# EAGLE design clock-test (EAGLE 5.11)
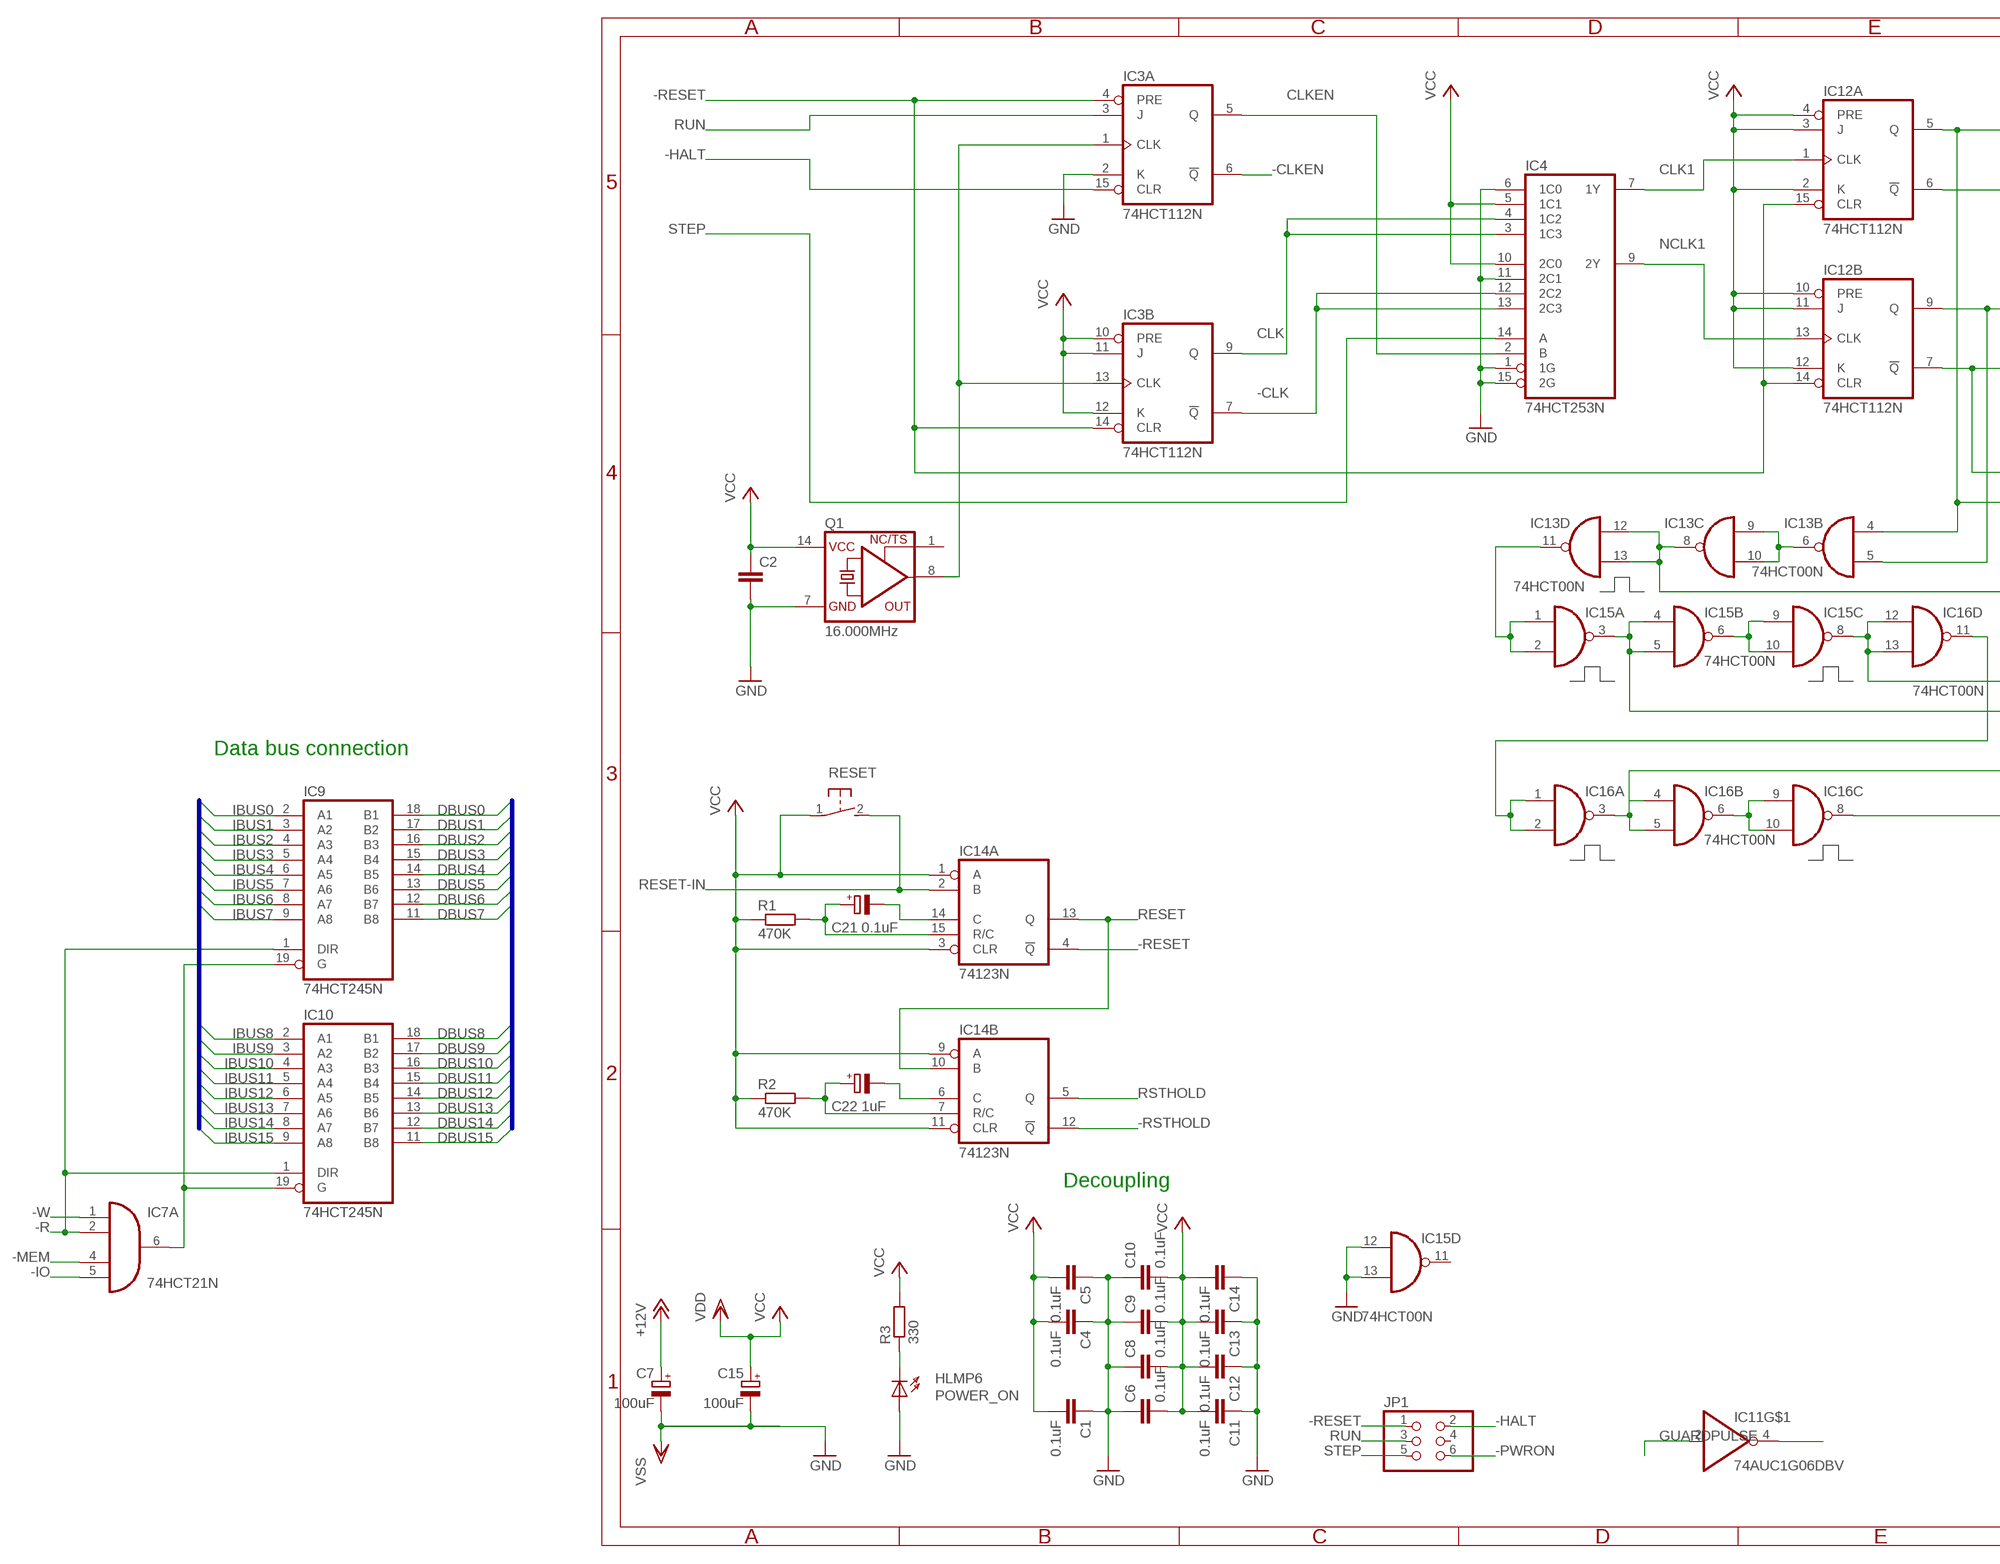
[diagram p0: schematic, sheet 1, part 1 of 2]
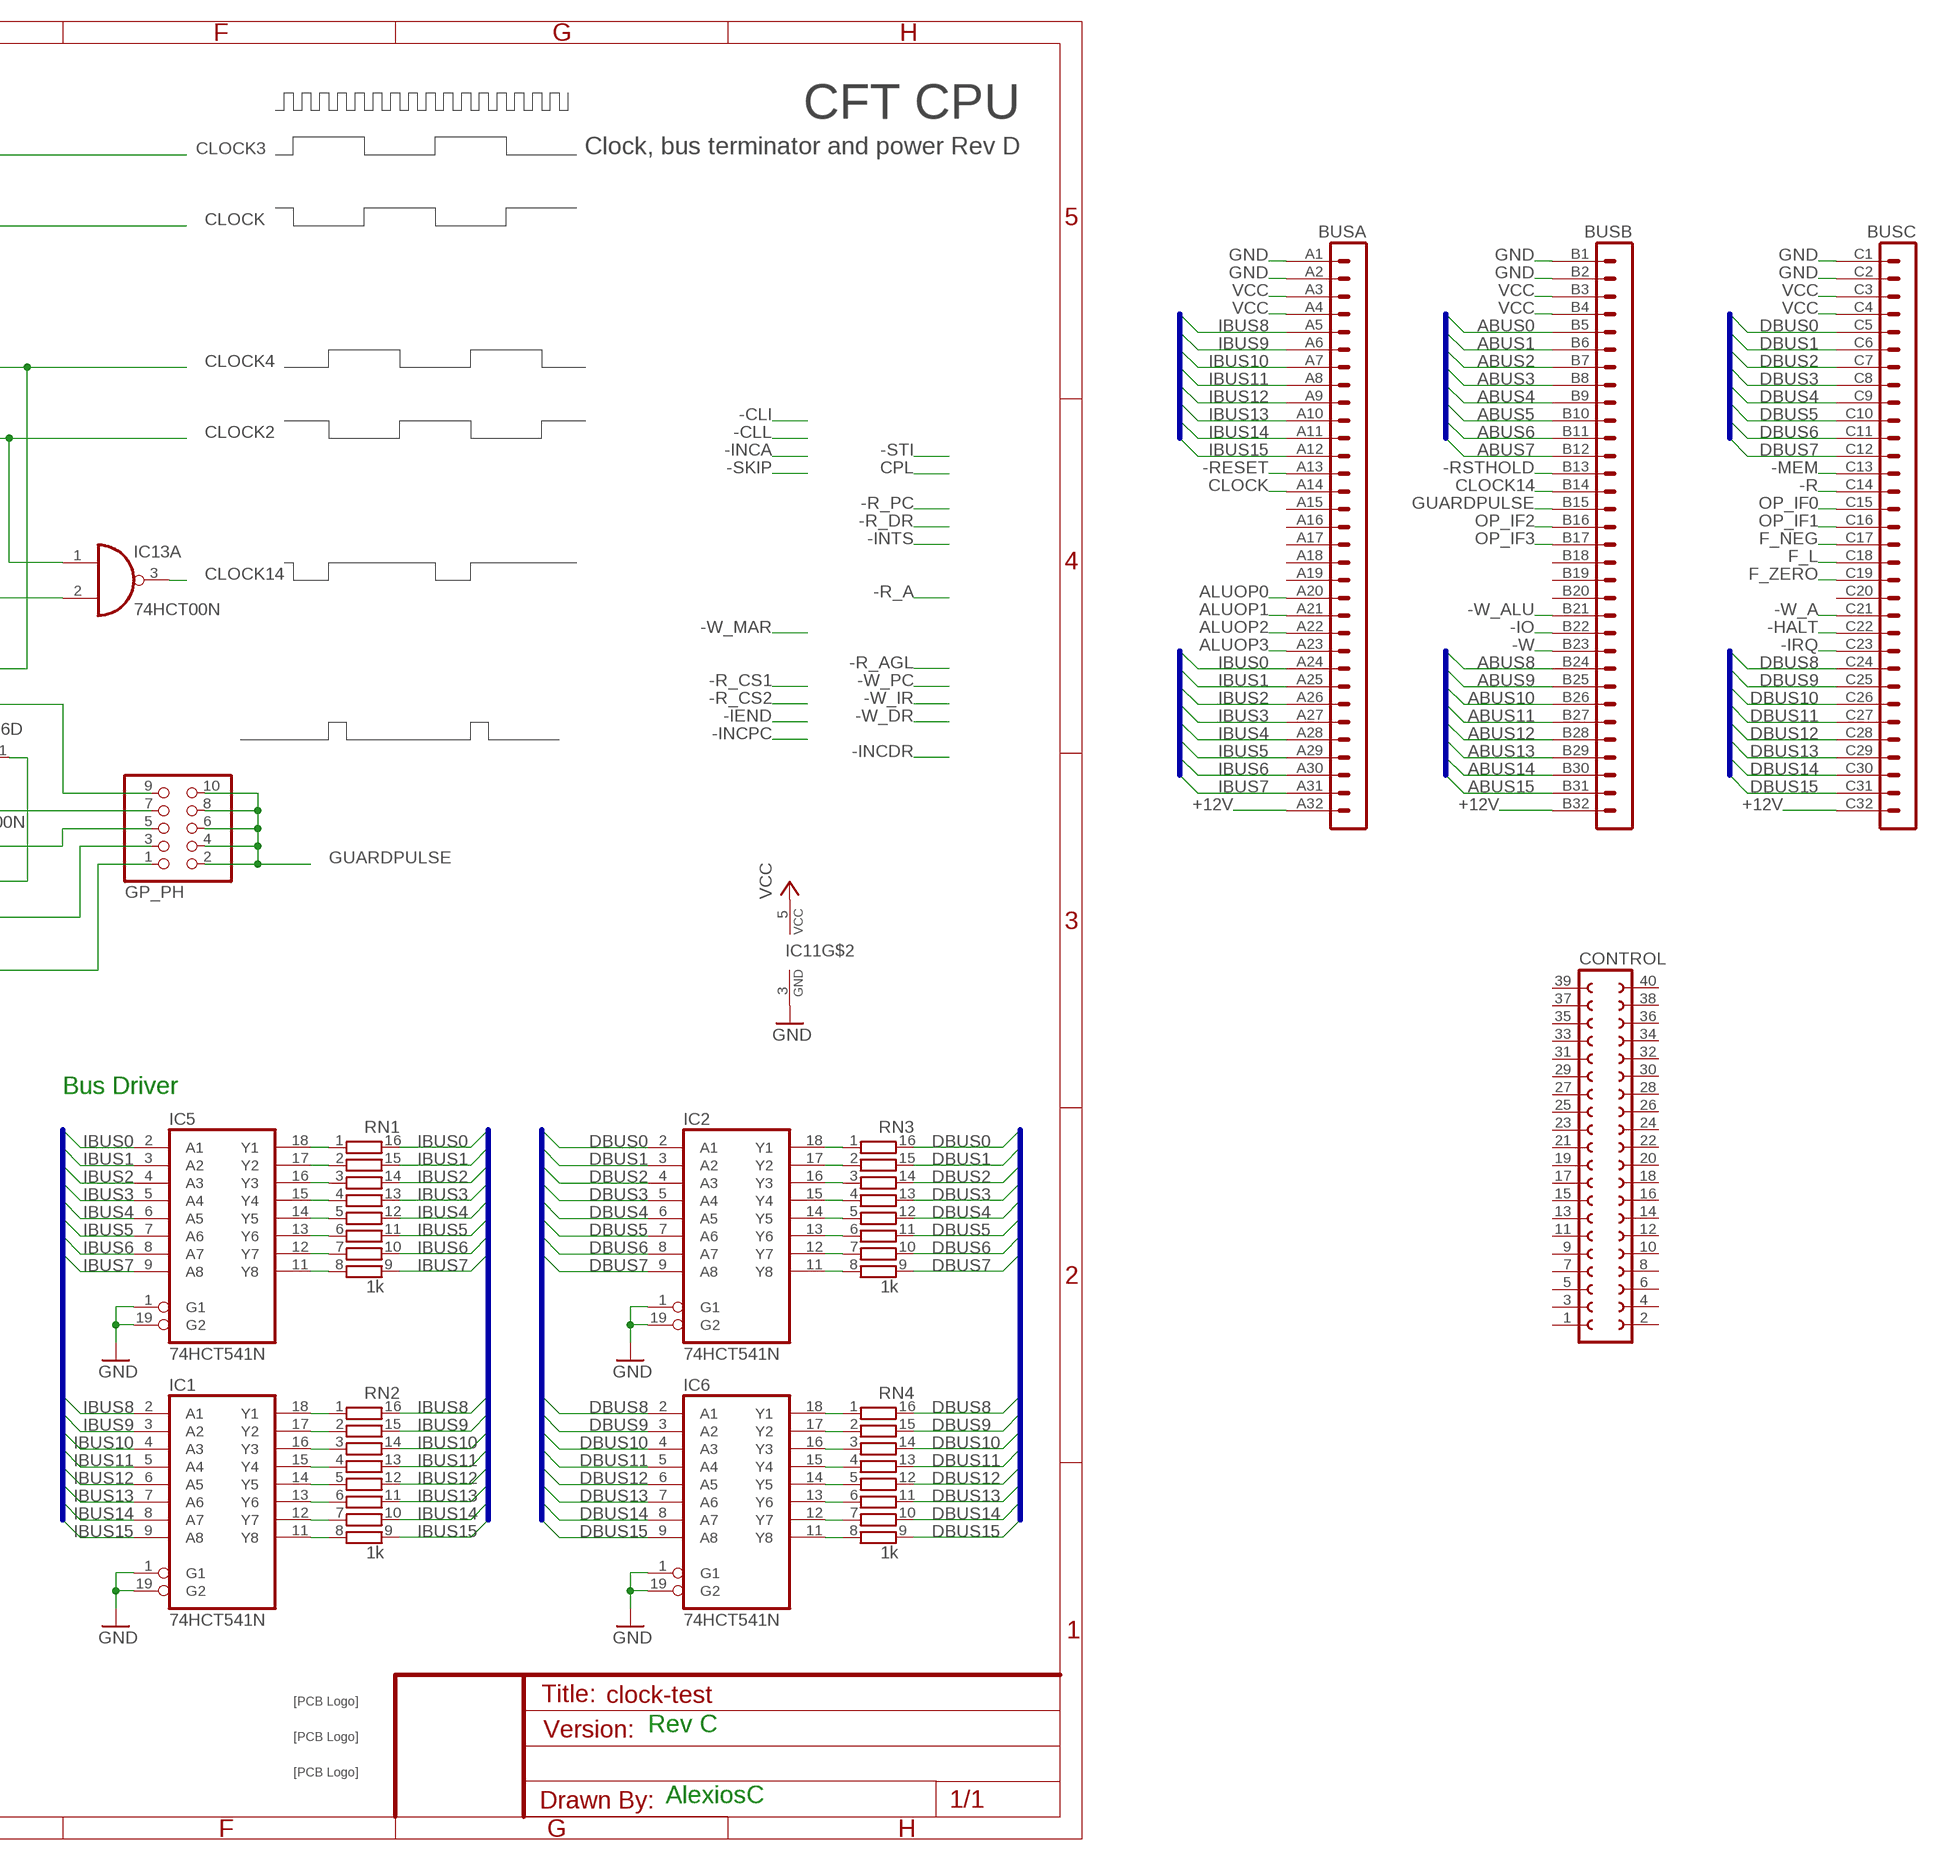
[diagram p1: schematic, sheet 1, part 2 of 2]

## Parts
BUS  VG96-3B  [VG96B]
C1  0.1uF  C-EU025-025X050  [C025-025X050]
C2  C-EU025-025X050  [C025-025X050]
C4  0.1uF  C-EU025-025X050  [C025-025X050]
C5  0.1uF  C-EU025-025X050  [C025-025X050]
C6  0.1uF  C-EU025-025X050  [C025-025X050]
C7  100uF  CPOL-EUE3.5-8  [E3,5-8]
C8  0.1uF  C-EU025-025X050  [C025-025X050]
C9  0.1uF  C-EU025-025X050  [C025-025X050]
C10  0.1uF  C-EU025-025X050  [C025-025X050]
C11  0.1uF  C-EU025-025X050  [C025-025X050]
C12  0.1uF  C-EU025-025X050  [C025-025X050]
C13  0.1uF  C-EU025-025X050  [C025-025X050]
C14  0.1uF  C-EU025-025X050  [C025-025X050]
C15  100uF  CPOL-EUE3.5-8  [E3,5-8]
C21  0.1uF  CPOL-EUE2.5-6  [E2,5-6]
C22  1uF  CPOL-EUE2.5-6  [E2,5-6]
CONTROL  FE20-2  [FE20-2]
GP_PH  PINHD-2X5/90  [2X05/90]
IC1  74HCT541N  [DIL20]
IC2  74HCT541N  [DIL20]
IC3  74HCT112N  [DIL16]
IC4  74HCT253N  [DIL16]
IC5  74HCT541N  [DIL20]
IC6  74HCT541N  [DIL20]
IC7  74HCT21N  [DIL14]
IC9  74HCT245N  [DIL20]
IC10  74HCT245N  [DIL20]
IC11  74AUC1G06DBV  [SOT23-5]
IC12  74HCT112N  [DIL16]
IC13  74HCT00N  [DIL14]
IC14  74123N  [DIL16]
IC15  74HCT00N  [DIL14]
IC16  74HCT00N  [DIL14]
JP1  PINHD-2X3/90  [2X03/90]
POWER_ON  HLMP6  [HLMP6]
Q1  16.000MHz  XO-14  [DIL14S]
R1  470K  R-EU_0204/7  [0204/7]
R2  470K  R-EU_0204/7  [0204/7]
R3  330  R-EU_0204/7  [0204/7]
RESET  31-XX  [B3F-31XX]
RN1  1k  8R-P  [DIL16]
RN2  1k  8R-P  [DIL16]
RN3  1k  8R-P  [DIL16]
RN4  1k  8R-P  [DIL16]
U$1  SIGNATUREPLANE  [SIGNATURE_PLANE]
U$2  SIGNATUREPLANE  [SIGNATURE_PLANE]
U$3  SIGNATURESILK  [SIGNATURE]

## Nets
+12V [12V]: BUS.A32 BUS.B32 BUS.C32 C7.+
-CLK: IC3.7(B:!Q) IC4.12(2C2) IC4.13(2C3)
-CLKEN: IC3.6(A:!Q)
-HALT: BUS.C22 IC3.15(A:CLR) JP1.2
-IO: BUS.B22 IC7.5(A:I3)
-IRQ: BUS.C23
-MEM: BUS.C13 IC7.4(A:I2)
-PWRON: JP1.6
-R: BUS.C14 IC7.2(A:I1) IC9.1(DIR) IC10.1(DIR)
-RESET: BUS.A13 IC3.4(A:PRE) IC3.14(B:CLR) IC12.14(B:CLR) IC12.15(A:CLR) IC14.4(A:!Q) JP1.1
-RSTHOLD: BUS.B13 IC14.12(B:!Q)
-W: BUS.B23 IC7.1(A:I0)
-W_A: BUS.C21
-W_ALU: BUS.B21
ABUS0: BUS.B5
ABUS1: BUS.B6
ABUS2: BUS.B7
ABUS3: BUS.B8
ABUS4: BUS.B9
ABUS5: BUS.B10
ABUS6: BUS.B11
ABUS7: BUS.B12
ABUS8: BUS.B24
ABUS9: BUS.B25
ABUS10: BUS.B26
ABUS11: BUS.B27
ABUS12: BUS.B28
ABUS13: BUS.B29
ABUS14: BUS.B30
ABUS15: BUS.B31
ALUOP0: BUS.A20 IC11.4(O)
ALUOP1: BUS.A21
ALUOP2: BUS.A22
ALUOP3: BUS.A23
CLK: IC3.9(B:Q) IC4.3(1C3) IC4.4(1C2)
CLK1: IC4.7(1Y) IC12.1(A:CLK)
CLKEN: IC3.5(A:Q) IC4.2(B)
CLOCK: BUS.A14 IC12.6(A:!Q)
CLOCK2: IC12.7(B:!Q) IC13.1(A:I0)
CLOCK3: IC12.5(A:Q) IC13.2(A:I1) IC13.4(B:I0)
CLOCK4: IC12.9(B:Q) IC13.5(B:I1)
CLOCK14: BUS.B14 IC13.3(A:O)
DBUS0: BUS.C5 IC2.2(A1) IC9.18(B1) RN3.16
DBUS1: BUS.C6 IC2.3(A2) IC9.17(B2) RN3.15
DBUS2: BUS.C7 IC2.4(A3) IC9.16(B3) RN3.14
DBUS3: BUS.C8 IC2.5(A4) IC9.15(B4) RN3.13
DBUS4: BUS.C9 IC2.6(A5) IC9.14(B5) RN3.12
DBUS5: BUS.C10 IC2.7(A6) IC9.13(B6) RN3.11
DBUS6: BUS.C11 IC2.8(A7) IC9.12(B7) RN3.10
DBUS7: BUS.C12 IC2.9(A8) IC9.11(B8) RN3.9
DBUS8: BUS.C24 IC6.2(A1) IC10.18(B1) RN4.16
DBUS9: BUS.C25 IC6.3(A2) IC10.17(B2) RN4.15
DBUS10: BUS.C26 IC6.4(A3) IC10.16(B3) RN4.14
DBUS11: BUS.C27 IC6.5(A4) IC10.15(B4) RN4.13
DBUS12: BUS.C28 IC6.6(A5) IC10.14(B5) RN4.12
DBUS13: BUS.C29 IC6.7(A6) IC10.13(B6) RN4.11
DBUS14: BUS.C30 IC6.8(A7) IC10.12(B7) RN4.10
DBUS15: BUS.C31 IC6.9(A8) IC10.11(B8) RN4.9
F_L: BUS.C18
F_NEG: BUS.C17
F_ZERO: BUS.C19
GND: BUS.A1 BUS.A2 BUS.B1 BUS.B2 BUS.C1 BUS.C2 C1.1 C2.2 C4.1 C5.1 C6.1 C7.- C8.1 C9.1 C10.1 C11.1 C12.1 C13.1 C14.1 IC1.1(G1) IC1.19(G2) IC2.1(G1) IC2.19(G2) IC3.2(A:K) IC4.1(1G) IC4.6(1C0) IC4.11(2C1) IC4.15(2G) IC5.1(G1) IC5.19(G2) IC6.1(G1) IC6.19(G2) IC11.3(GND) IC15.12(D:I0) IC15.13(D:I1) POWER_ON.A Q1.7(GND) ; supply symbol labelled VSS
GUARDPULSE: BUS.B15 GP_PH.2 GP_PH.4 GP_PH.6 GP_PH.8 GP_PH.10 IC11.2(I)
IBUS0: BUS.A24 IC5.2(A1) IC9.2(A1) RN1.16
IBUS1: BUS.A25 IC5.3(A2) IC9.3(A2) RN1.15
IBUS2: BUS.A26 IC5.4(A3) IC9.4(A3) RN1.14
IBUS3: BUS.A27 IC5.5(A4) IC9.5(A4) RN1.13
IBUS4: BUS.A28 IC5.6(A5) IC9.6(A5) RN1.12
IBUS5: BUS.A29 IC5.7(A6) IC9.7(A6) RN1.11
IBUS6: BUS.A30 IC5.8(A7) IC9.8(A7) RN1.10
IBUS7: BUS.A31 IC5.9(A8) IC9.9(A8) RN1.9
IBUS8: BUS.A5 IC1.2(A1) IC10.2(A1) RN2.16
IBUS9: BUS.A6 IC1.3(A2) IC10.3(A2) RN2.15
IBUS10: BUS.A7 IC1.4(A3) IC10.4(A3) RN2.14
IBUS11: BUS.A8 IC1.5(A4) IC10.5(A4) RN2.13
IBUS12: BUS.A9 IC1.6(A5) IC10.6(A5) RN2.12
IBUS13: BUS.A10 IC1.7(A6) IC10.7(A6) RN2.11
IBUS14: BUS.A11 IC1.8(A7) IC10.8(A7) RN2.10
IBUS15: BUS.A12 IC1.9(A8) IC10.9(A8) RN2.9
N$1: IC5.18(Y1) RN1.1
N$2: GP_PH.1 IC16.8(C:O)
N$3: C15.-
N$4: IC5.17(Y2) RN1.2
N$5: IC3.1(A:CLK) IC3.13(B:CLK) Q1.8(OUT)
N$6: C21.+ IC14.15(A:R/C) R1.2
N$7: IC5.16(Y3) RN1.3
N$8: C21.- IC14.14(A:C)
N$9: C22.+ IC14.7(B:R/C) R2.2
N$10: C22.- IC14.6(B:C)
N$11: GP_PH.5 IC15.3(A:O) IC15.4(B:I0) IC15.5(B:I1)
N$12: IC15.6(B:O) IC15.9(C:I0) IC15.10(C:I1)
N$13: GP_PH.7 IC15.8(C:O) IC16.12(D:I0) IC16.13(D:I1)
N$14: IC16.1(A:I0) IC16.2(A:I1) IC16.11(D:O)
N$15: GP_PH.3 IC16.3(A:O) IC16.4(B:I0) IC16.5(B:I1)
N$16: IC16.6(B:O) IC16.9(C:I0) IC16.10(C:I1)
N$17: IC5.15(Y4) RN1.4
N$18: IC13.6(B:O) IC13.9(C:I0) IC13.10(C:I1)
N$19: GP_PH.9 IC13.8(C:O) IC13.12(D:I0) IC13.13(D:I1)
N$20: IC13.11(D:O) IC15.1(A:I0) IC15.2(A:I1)
N$21: IC5.14(Y5) RN1.5
N$22: IC5.13(Y6) RN1.6
N$23: IC5.12(Y7) RN1.7
N$24: IC5.11(Y8) RN1.8
N$25: IC1.18(Y1) RN2.1
N$26: IC1.17(Y2) RN2.2
N$27: IC1.16(Y3) RN2.3
N$28: IC1.15(Y4) RN2.4
N$29: IC1.14(Y5) RN2.5
N$30: IC1.13(Y6) RN2.6
N$31: IC1.12(Y7) RN2.7
N$32: IC1.11(Y8) RN2.8
N$33: IC2.18(Y1) RN3.1
N$34: IC2.17(Y2) RN3.2
N$35: IC2.16(Y3) RN3.3
N$36: IC2.15(Y4) RN3.4
N$37: IC2.14(Y5) RN3.5
N$38: IC2.13(Y6) RN3.6
N$39: IC2.12(Y7) RN3.7
N$40: IC2.11(Y8) RN3.8
N$41: IC6.18(Y1) RN4.1
N$42: IC6.17(Y2) RN4.2
N$43: IC6.16(Y3) RN4.3
N$44: IC6.15(Y4) RN4.4
N$45: IC6.14(Y5) RN4.5
N$46: IC6.13(Y6) RN4.6
N$47: IC6.12(Y7) RN4.7
N$48: IC6.11(Y8) RN4.8
N$49: IC7.6(A:O) IC9.19(G) IC10.19(G)
NCLK1: IC4.9(2Y) IC12.13(B:CLK)
OP_IF0: BUS.C15
OP_IF1: BUS.C16
OP_IF2: BUS.B16
OP_IF3: BUS.B17
POWERLED: POWER_ON.K R3.1
RESET: IC14.10(B:B) IC14.13(A:Q)
RESET-IN: IC14.2(A:B) RESET.2(S)
RSTHOLD: IC14.5(B:Q)
RUN: IC3.3(A:J) JP1.3
STEP: IC4.14(A) JP1.5
VCC: BUS.A3 BUS.A4 BUS.B3 BUS.B4 BUS.C3 BUS.C4 C1.2 C2.1 C4.2 C5.2 C6.2 C8.2 C9.2 C10.2 C11.2 C12.2 C13.2 C14.2 C15.+ IC3.10(B:PRE) IC3.11(B:J) IC3.12(B:K) IC4.5(1C1) IC4.10(2C0) IC11.5(VCC) IC12.2(A:K) IC12.3(A:J) IC12.4(A:PRE) IC12.10(B:PRE) IC12.11(B:J) IC12.12(B:K) IC14.1(A:A) IC14.3(A:CLR) IC14.9(B:A) IC14.11(B:CLR) Q1.14(VCC) R1.1 R2.1 R3.2 RESET.1(P) ; supply symbol labelled VDD
Unconnected: BUS.A15 BUS.A16 BUS.A17 BUS.A18 BUS.A19 BUS.B18 BUS.B19 BUS.B20 BUS.C20 CONTROL.1 CONTROL.2 CONTROL.3 CONTROL.4 CONTROL.5 CONTROL.6 CONTROL.7 CONTROL.8 CONTROL.9 CONTROL.10 CONTROL.11 CONTROL.12 CONTROL.13 CONTROL.14 CONTROL.15 CONTROL.16 CONTROL.17 CONTROL.18 CONTROL.19 CONTROL.20 CONTROL.21 CONTROL.22 CONTROL.23 CONTROL.24 CONTROL.25 CONTROL.26 CONTROL.27 CONTROL.28 CONTROL.29 CONTROL.30 CONTROL.31 CONTROL.32 CONTROL.33 CONTROL.34 CONTROL.35 CONTROL.36 CONTROL.37 CONTROL.38 CONTROL.39 CONTROL.40 IC7.8(B:O) IC7.9(B:I0) IC7.10(B:I1) IC7.12(B:I2) IC7.13(B:I3) IC15.11(D:O) JP1.4 Q1.1(TS)

## Buses
ABUS[0..15]
DBUS[0..15]
IBUS[0..15]

## Notes on the sheet
- CFT CPU
- Clock, bus terminator and power Rev D
- Data bus connection
- Bus Driver
- Decoupling
- Rev C
- AlexiosC

## Power pins joined to a net without a drawn wire
GND: IC1.10(GND) IC2.10(GND) IC3.8(P:GND) IC4.8(GND) IC5.10(GND) IC6.10(GND) IC7.7(P:GND) IC9.10(GND) IC10.10(GND) IC12.8(P:GND) IC13.7(P:GND) IC14.8(P:GND) IC15.7(P:GND) IC16.7(P:GND)
VCC: IC1.20(VCC) IC2.20(VCC) IC3.16(P:VCC) IC4.16(VCC) IC5.20(VCC) IC6.20(VCC) IC7.14(P:VCC) IC9.20(VCC) IC10.20(VCC) IC12.16(P:VCC) IC13.14(P:VCC) IC14.16(P:VCC) IC15.14(P:VCC) IC16.14(P:VCC)

## Library data of the parts
BUS = 19inch:VG96-3: PCB EUROCARD, 96-pin type C/ABC, 2.54 mm
C1 C2 C4-C6 C8-C14 = rcl:C-EU: CAPACITOR, European symbol
C7 C15 C21 C22 = rcl:CPOL-EU: POLARIZED CAPACITOR, European symbol
CONTROL = con-lsta:FE20-2: FEMALE HEADER; OC_FARNELL: unknown; OC_NEWARK: unknown
GP_PH = pinhead:PINHD-2X5: PIN HEADER
IC1 IC2 IC5 IC6 = 74xx-eu:74*541: Octal BUFFER and LINE DRIVER, 3-state
IC3 IC12 = 74xx-eu:74*112: Dual J-K negative edge triggered FLIP FLOP, preset and clear
IC4 = 74xx-eu:74*253: Dual 4-to 1 line data SELECTOR/MULTIPLEXER, 3-state
IC7 = 74xx-eu:74*21: Dual 4-input AND gate
IC9 IC10 = 74xx-eu:74*245: Octal BUS TRANSCEIVER, 3-state
IC11 = 74xx-little-de:74*1G06: Single Inverter Buffer/Driver With Open-Drain Output
IC13 IC15 IC16 = 74xx-eu:74*00: Quad 2-input NAND gate
IC14 = 74xx-eu:74*123: Retriggerable monostable MULTIVIBRATOR
JP1 = pinhead:PINHD-2X3: PIN HEADER
POWER_ON = display-hp:HLMP6: LED 2mm horizontal; MF: AGILENT TECHNOLOGIES; MPN: HLMP-6500; OC_FARNELL: 1652490; OC_NEWARK: 40K0088
Q1 = crystal:XO-14: CRYSTAL RESONATOR
R1-R3 = resistor:R-EU_: RESISTOR, European symbol
RESET = switch-omron:31-XX: OMRON SWITCH
RN1-RN4 = resistor-dil:8R-P: DIL RESISTOR; OC_FARNELL: unknown; OC_NEWARK: unknown
U$1-U$3 = alexios:SIGNATURE: Soup signature

## Net classes
0 default: width 0.406 mm, clearance 0.305 mm
1 Decoupling: width 1.27 mm
2 12V: width 1.016 mm, clearance 1.016 mm

## Board
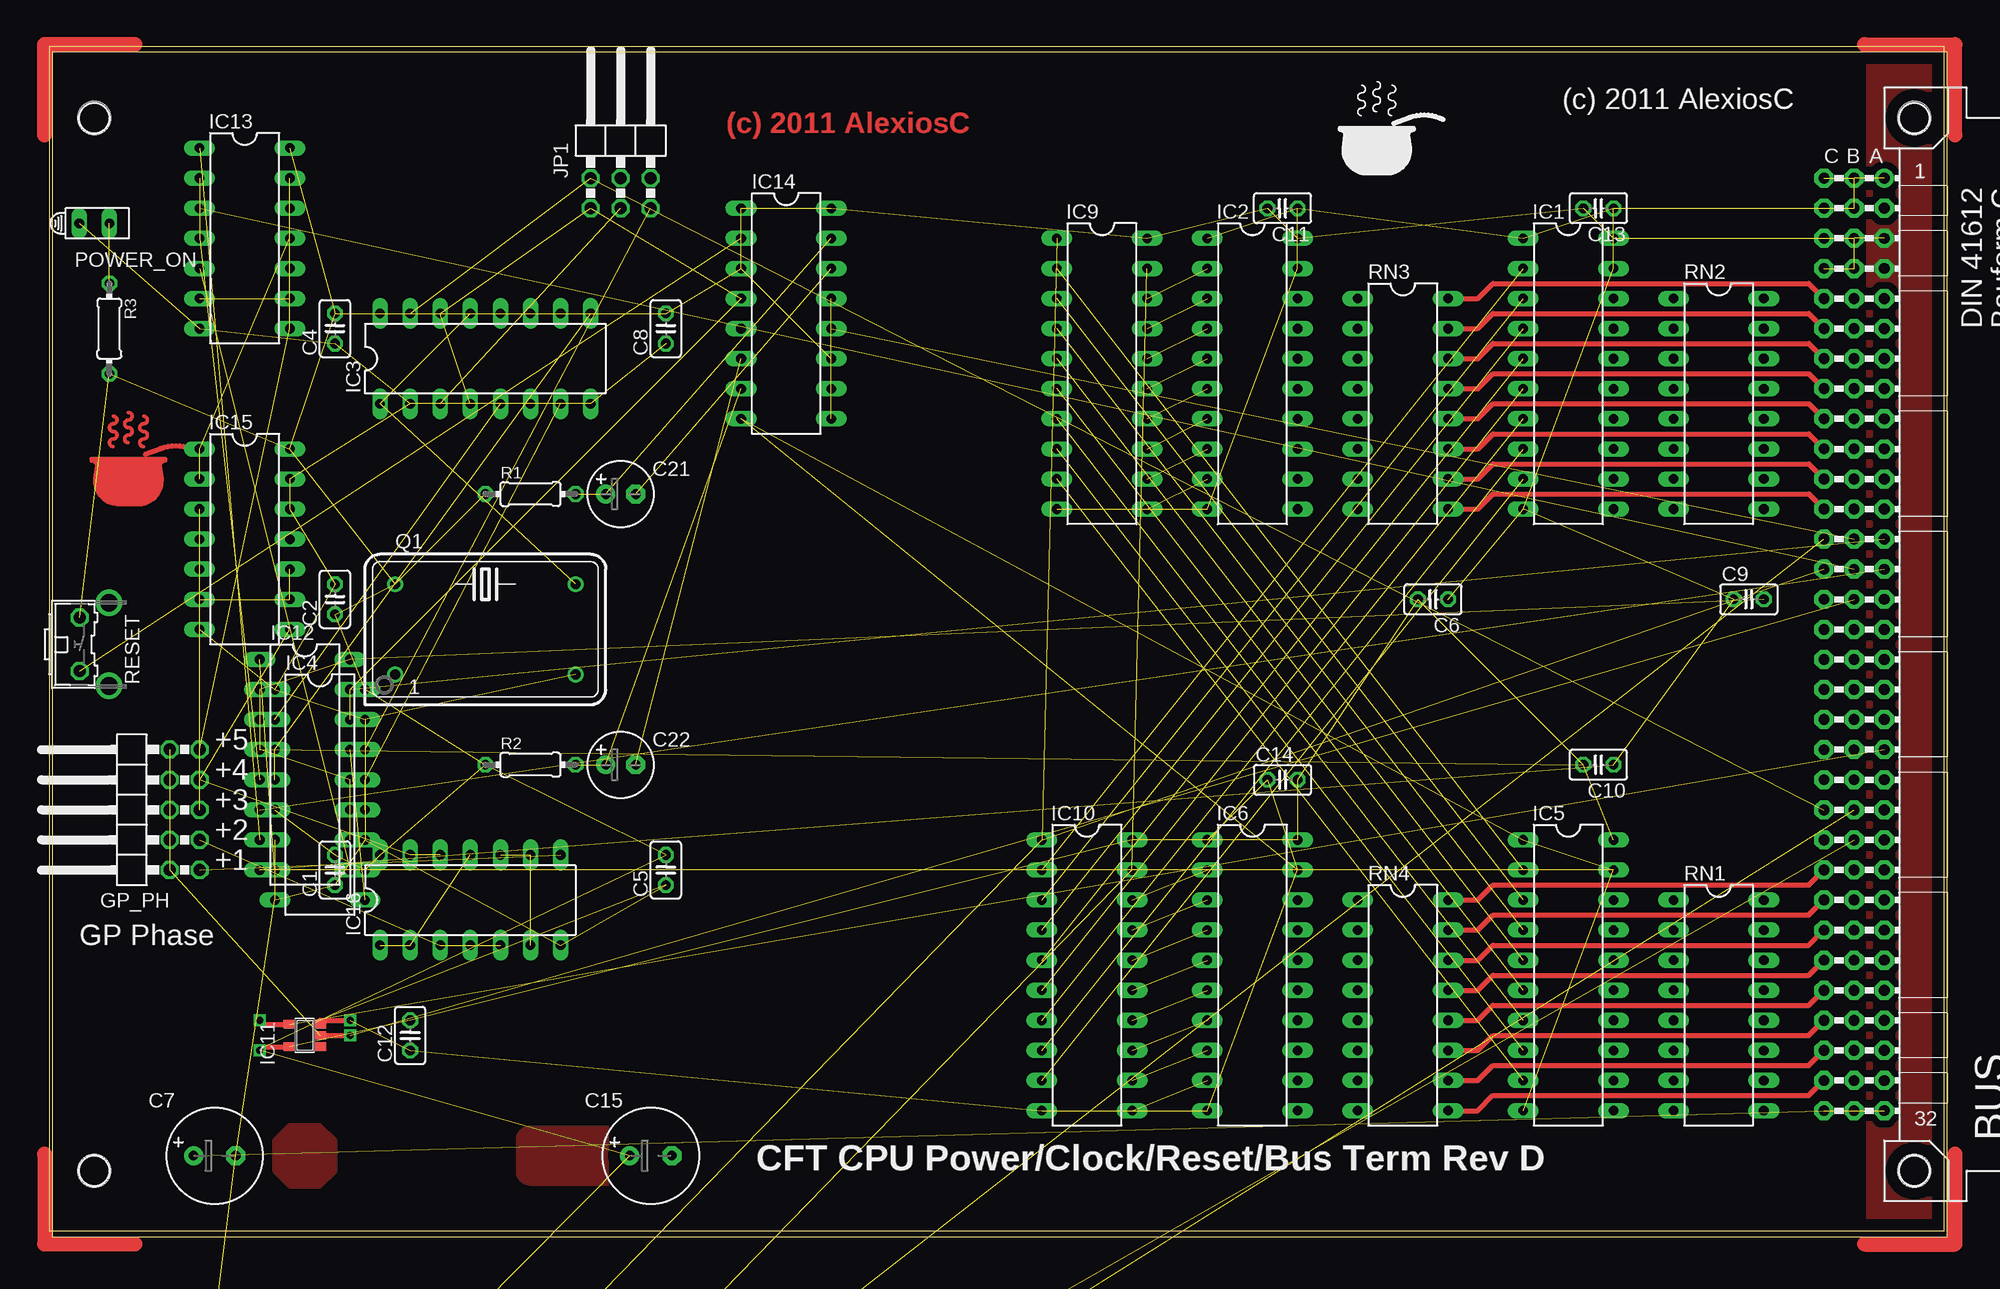
[diagram p2: board, top side]
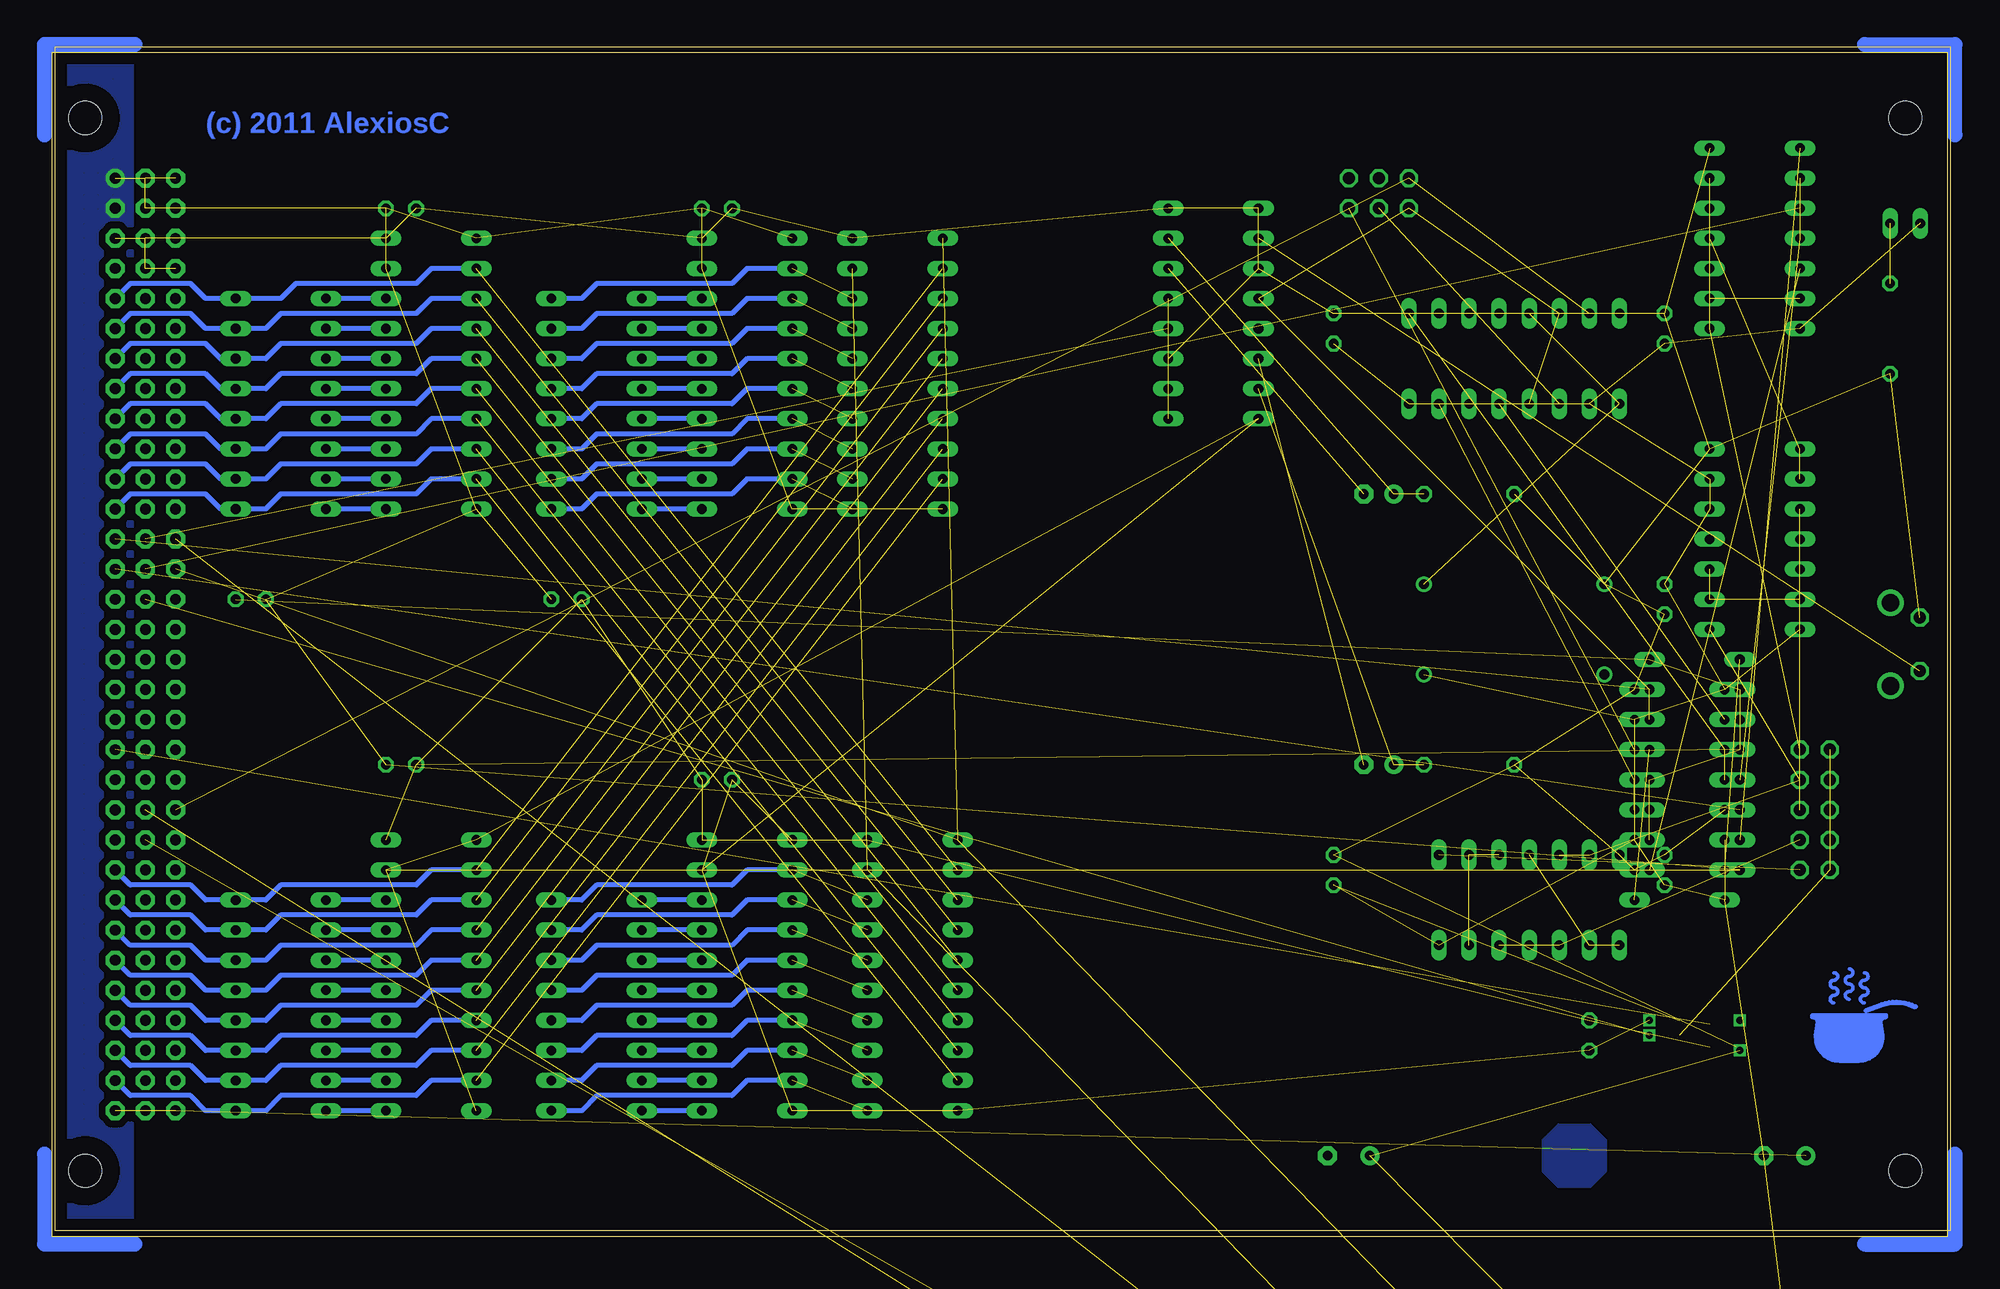
[diagram p3: board, bottom side, seen from below]

Size 160 x 100 mm. Coordinates in mm from the lower left corner, seen from the top.
Outline: 0,0 160,0 160,100 0,100 0,0
Copper layers (1*16): Top 0.035mm / dielectric 1.5mm / Bottom 0.035mm
Design rules "olimex-10mil": minimum track width 10mil, minimum drill 24mil, track to track 10mil, track to pad 10mil, pad to pad 10mil, via to via 10mil, smd to smd 10mil, copper to edge 40mil, drill to drill 10mil, minimum pad ring 10mil, minimum via ring 8mil, stop-mask expansion 0mil, vias tented up to drill 0mil, thermal gap 10mil

### Footprints (pad centres in the part's own frame; a part is rotated, then mirrored left to right if it is on the bottom)
VG96B = drill 0.914 pad 1.6 round: A1 154.94,39.37 | drill 0.914 pad 1.6 octagon: A2 154.94,36.83; A3 154.94,34.29; A4 154.94,31.75; A5 154.94,29.21; A6 154.94,26.67; A7 154.94,24.13; A8 154.94,21.59; A9 154.94,19.05; A10 154.94,16.51; A11 154.94,13.97; A12 154.94,11.43; A13 154.94,8.89; A14 154.94,6.35; A15 154.94,3.81; A16 154.94,1.27; A17 154.94,-1.27; A18 154.94,-3.81; A19 154.94,-6.35; A20 154.94,-8.89; A21 154.94,-11.43; A22 154.94,-13.97; A23 154.94,-16.51; A24 154.94,-19.05; A25 154.94,-21.59; A26 154.94,-24.13; A27 154.94,-26.67; A28 154.94,-29.21; A29 154.94,-31.75; A30 154.94,-34.29; A31 154.94,-36.83; A32 154.94,-39.37; B1 152.4,39.37; B2 152.4,36.83; B3 152.4,34.29; B4 152.4,31.75; B5 152.4,29.21; B6 152.4,26.67; B7 152.4,24.13; B8 152.4,21.59; B9 152.4,19.05; B10 152.4,16.51; B11 152.4,13.97; B12 152.4,11.43; B13 152.4,8.89; B14 152.4,6.35; B15 152.4,3.81; B16 152.4,1.27; B17 152.4,-1.27; B18 152.4,-3.81; B19 152.4,-6.35; B20 152.4,-8.89; B21 152.4,-11.43; B22 152.4,-13.97; B23 152.4,-16.51; B24 152.4,-19.05; B25 152.4,-21.59; B26 152.4,-24.13; B27 152.4,-26.67; B28 152.4,-29.21; B29 152.4,-31.75; B30 152.4,-34.29; B31 152.4,-36.83; B32 152.4,-39.37; C1 149.86,39.37; C2 149.86,36.83; C3 149.86,34.29; C4 149.86,31.75; C5 149.86,29.21; C6 149.86,26.67; C7 149.86,24.13; C8 149.86,21.59; C9 149.86,19.05; C10 149.86,16.51; C11 149.86,13.97; C12 149.86,11.43; C13 149.86,8.89; C14 149.86,6.35; C15 149.86,3.81; C16 149.86,1.27; C17 149.86,-1.27; C18 149.86,-3.81; C19 149.86,-6.35; C20 149.86,-8.89; C21 149.86,-11.43; C22 149.86,-13.97; C23 149.86,-16.51; C24 149.86,-19.05; C25 149.86,-21.59; C26 149.86,-24.13; C27 149.86,-26.67; C28 149.86,-29.21; C29 149.86,-31.75; C30 149.86,-34.29; C31 149.86,-36.83; C32 149.86,-39.37 | hole 2.794: 157.48,44.45; 157.48,-44.45; 3.81,44.45; 3.81,-44.45
C025-025X050 = drill 0.813 octagon: 1 -1.27,0; 2 1.27,0
E3,5-8 = drill 0.813 pad 1.6 round: + -1.778,0 | drill 0.813 pad 1.6 octagon: - 1.778,0
E2,5-6 = drill 0.813 pad 1.6 round: + -1.27,0 | drill 0.813 pad 1.6 octagon: - 1.27,0
FE20-2 = drill 0.914 round: 1 -24.13,1.27 | drill 0.914 octagon: 2 -24.13,-1.27; 3 -21.59,1.27; 4 -21.59,-1.27; 5 -19.05,1.27; 6 -19.05,-1.27; 7 -16.51,1.27; 8 -16.51,-1.27; 9 -13.97,1.27; 10 -13.97,-1.27; 11 -11.43,1.27; 12 -11.43,-1.27; 13 -8.89,1.27; 14 -8.89,-1.27; 15 -6.35,1.27; 16 -6.35,-1.27; 17 -3.81,1.27; 18 -3.81,-1.27; 19 -1.27,1.27; 20 -1.27,-1.27; 21 1.27,1.27; 22 1.27,-1.27; 23 3.81,1.27; 24 3.81,-1.27; 25 6.35,1.27; 26 6.35,-1.27; 27 8.89,1.27; 28 8.89,-1.27; 29 11.43,1.27; 30 11.43,-1.27; 31 13.97,1.27; 32 13.97,-1.27; 33 16.51,1.27; 34 16.51,-1.27; 35 19.05,1.27; 36 19.05,-1.27; 37 21.59,1.27; 38 21.59,-1.27; 39 24.13,1.27; 40 24.13,-1.27
2X05/90 = drill 1.016 octagon: 1 -5.08,-6.35; 2 -5.08,-3.81; 3 -2.54,-6.35; 4 -2.54,-3.81; 5 0,-6.35; 6 0,-3.81; 7 2.54,-6.35; 8 2.54,-3.81; 9 5.08,-6.35; 10 5.08,-3.81
DIL20 = drill 0.813 long: 1 -11.43,-3.81; 2 -8.89,-3.81; 3 -6.35,-3.81; 4 -3.81,-3.81; 5 -1.27,-3.81; 6 1.27,-3.81; 7 3.81,-3.81; 8 6.35,-3.81; 9 8.89,-3.81; 10 11.43,-3.81; 11 11.43,3.81; 12 8.89,3.81; 13 6.35,3.81; 14 3.81,3.81; 15 1.27,3.81; 16 -1.27,3.81; 17 -3.81,3.81; 18 -6.35,3.81; 19 -8.89,3.81; 20 -11.43,3.81
DIL16 = drill 0.813 long: 1 -8.89,-3.81; 2 -6.35,-3.81; 3 -3.81,-3.81; 4 -1.27,-3.81; 5 1.27,-3.81; 6 3.81,-3.81; 7 6.35,-3.81; 8 8.89,-3.81; 9 8.89,3.81; 10 6.35,3.81; 11 3.81,3.81; 12 1.27,3.81; 13 -1.27,3.81; 14 -3.81,3.81; 15 -6.35,3.81; 16 -8.89,3.81
DIL14 = drill 0.813 long: 1 -7.62,-3.81; 2 -5.08,-3.81; 3 -2.54,-3.81; 4 0,-3.81; 5 2.54,-3.81; 6 5.08,-3.81; 7 7.62,-3.81; 8 7.62,3.81; 9 5.08,3.81; 10 2.54,3.81; 11 0,3.81; 12 -2.54,3.81; 13 -5.08,3.81; 14 -7.62,3.81
SOT23-5 = smd 0.69 x 0.99: 1 -0.95,-1.29; 2 0,-1.29; 3 0.95,-1.29; 4 0.95,1.3; 5 -0.95,1.3
2X03/90 = drill 1.016 octagon: 1 -2.54,-6.35; 2 -2.54,-3.81; 3 0,-6.35; 4 0,-3.81; 5 2.54,-6.35; 6 2.54,-3.81
HLMP6 = drill 0.813 long: A -1.27,0; K 1.27,0
DIL14S = drill 0.813 round: 1 -7.62,-3.81; 7 7.62,-3.81; 8 7.62,3.81; 14 -7.62,3.81
0204/7 = drill 0.813 octagon: 1 -3.81,0; 2 3.81,0
B3F-31XX = drill 1.016 octagon: 1 -2.261,-1.245; 2 2.261,-1.245 | drill 1.499 pad 2.159 round: 3 -3.505,1.245; 4 3.505,1.245

### Placement (x,y rotation side)
BUS  0,49.53 0 top
C1  24.13,30.48 90 top
C2  24.13,53.34 90 top
C4  24.13,76.2 90 top
C5  52.07,30.48 90 top
C6  116.84,53.34 180 top
C7  13.97,6.35 0 top
C8  52.07,76.2 90 top
C9  143.51,53.34 0 top
C10  130.81,39.37 180 top
C11  104.14,86.36 180 top
C12  30.48,16.51 90 top
C13  130.81,86.36 180 top
C14  104.14,38.1 0 top
C15  50.8,6.35 0 top
C21  48.26,62.23 0 top
C22  48.26,39.37 0 top
CONTROL  13.97,-67.31 0 top  (outside the outline)
GP_PH  6.35,35.56 90 top
IC1  128.27,72.39 270 top
IC2  101.6,72.39 270 top
IC3  36.83,73.66 0 top
IC4  22.86,36.83 270 top
IC5  128.27,21.59 270 top
IC6  101.6,21.59 270 top
IC7  0,-54.61 0 top  (outside the outline)
IC9  88.9,72.39 270 top
IC10  87.63,21.59 270 top
IC11  21.59,16.51 90 top
IC12  21.59,39.37 270 top
IC13  16.51,83.82 270 top
IC14  62.23,77.47 270 top
IC15  16.51,58.42 270 top
IC16  35.56,27.94 0 top
JP1  48.26,92.71 0 top
POWER_ON  3.81,85.09 0 top
Q1  36.83,50.8 0 top
R1  40.64,62.23 0 top
R2  40.64,39.37 0 top
R3  5.08,76.2 270 top
RESET  3.81,49.53 270 top
RN1  140.97,19.05 270 top
RN2  140.97,69.85 270 top
RN3  114.3,69.85 270 top
RN4  114.3,19.05 270 top
U$1  3.81,60.96 0 top
U$2  11.43,13.97 0 bottom
U$3  109.22,88.9 0 top

### Tracks (layer width: path | path; a pad name or v marks a point on that pad's centre or on a via)
+12V  (3 unrouted)
  pour Top (isolate 1.016, no thermals): 40.64,7.62 40.64,5.08 49.53,5.08 49.53,7.62
-CLK  (2 unrouted)
-HALT  (2 unrouted)
-IO  (1 unrouted)
-MEM  (1 unrouted)
-R  (3 unrouted)
-RESET  (6 unrouted)
-RSTHOLD  (1 unrouted)
-W  (1 unrouted)
ALUOP0  (via drill 0.6)  (1 unrouted)
  Top 0.406: IC11.4 18.1,17.46 v17.78,17.78
CLK  (2 unrouted)
CLK1  (1 unrouted)
CLKEN  (1 unrouted)
CLOCK  (1 unrouted)
CLOCK2  (1 unrouted)
CLOCK3  (2 unrouted)
CLOCK4  (1 unrouted)
CLOCK14  (1 unrouted)
DBUS0  (1 unrouted)
  Top 0.406: RN3.16 120.65,78.74 121.92,80.01 148.59,80.01 BUS.C5
  Bottom 0.406: IC2.2 101.6,81.28 102.87,80.01 114.3,80.01 115.57,78.74 RN3.16
DBUS1  (1 unrouted)
  Top 0.406: RN3.15 120.65,76.2 121.92,77.47 148.59,77.47 BUS.C6
  Bottom 0.406: IC2.3 101.6,78.74 102.87,77.47 114.3,77.47 115.57,76.2 RN3.15
DBUS2  (1 unrouted)
  Top 0.406: RN3.14 120.65,73.66 121.92,74.93 148.59,74.93 BUS.C7
  Bottom 0.406: IC2.4 101.6,76.2 102.87,74.93 114.3,74.93 115.57,73.66 RN3.14
DBUS3  (1 unrouted)
  Top 0.406: RN3.13 120.65,71.12 121.92,72.39 148.59,72.39 BUS.C8
  Bottom 0.406: IC2.5 101.6,73.66 102.87,72.39 114.3,72.39 115.57,71.12 RN3.13
DBUS4  (1 unrouted)
  Top 0.406: RN3.12 120.65,68.58 121.92,69.85 148.59,69.85 BUS.C9
  Bottom 0.406: IC2.6 101.6,71.12 102.87,69.85 114.3,69.85 115.57,68.58 RN3.12
DBUS5  (1 unrouted)
  Top 0.406: RN3.11 120.65,66.04 121.92,67.31 148.59,67.31 BUS.C10
  Bottom 0.406: IC2.7 101.6,68.58 102.87,67.31 114.3,67.31 115.57,66.04 RN3.11
DBUS6  (1 unrouted)
  Top 0.406: RN3.10 120.65,63.5 121.92,64.77 148.59,64.77 BUS.C11
  Bottom 0.406: IC2.8 101.6,66.04 102.87,64.77 114.3,64.77 115.57,63.5 RN3.10
DBUS7  (1 unrouted)
  Top 0.406: RN3.9 120.65,60.96 121.92,62.23 148.59,62.23 BUS.C12
  Bottom 0.406: IC2.9 101.6,63.5 102.87,62.23 114.3,62.23 115.57,60.96 RN3.9
DBUS8  (1 unrouted)
  Top 0.406: RN4.16 120.65,27.94 121.92,29.21 148.59,29.21 BUS.C24
  Bottom 0.406: IC6.2 101.6,30.48 102.87,29.21 114.3,29.21 115.57,27.94 RN4.16
DBUS9  (1 unrouted)
  Top 0.406: RN4.15 120.65,25.4 121.92,26.67 148.59,26.67 BUS.C25
  Bottom 0.406: IC6.3 101.6,27.94 102.87,26.67 114.3,26.67 115.57,25.4 RN4.15
DBUS10  (1 unrouted)
  Top 0.406: RN4.14 120.65,22.86 121.92,24.13 148.59,24.13 BUS.C26
  Bottom 0.406: IC6.4 101.6,25.4 102.87,24.13 114.3,24.13 115.57,22.86 RN4.14
DBUS11  (1 unrouted)
  Top 0.406: RN4.13 120.65,20.32 121.92,21.59 148.59,21.59 BUS.C27
  Bottom 0.406: IC6.5 101.6,22.86 102.87,21.59 114.3,21.59 115.57,20.32 RN4.13
DBUS12  (1 unrouted)
  Top 0.406: RN4.12 120.65,17.78 121.92,19.05 148.59,19.05 BUS.C28
  Bottom 0.406: IC6.6 101.6,20.32 102.87,19.05 114.3,19.05 115.57,17.78 RN4.12
DBUS13  (1 unrouted)
  Top 0.406: RN4.11 120.65,15.24 121.92,16.51 148.59,16.51 BUS.C29
  Bottom 0.406: IC6.7 101.6,17.78 102.87,16.51 114.3,16.51 115.57,15.24 RN4.11
DBUS14  (1 unrouted)
  Top 0.406: RN4.10 120.65,12.7 121.92,13.97 148.59,13.97 BUS.C30
  Bottom 0.406: IC6.8 101.6,15.24 102.87,13.97 114.3,13.97 115.57,12.7 RN4.10
DBUS15  (1 unrouted)
  Top 0.406: RN4.9 120.65,10.16 121.92,11.43 148.59,11.43 BUS.C31
  Bottom 0.406: IC6.9 101.6,12.7 102.87,11.43 114.3,11.43 115.57,10.16 RN4.9
GND  (via drill 0.6)  (49 unrouted)
  Top 0.406: IC11.3 22.88,17.8 v25.4,17.78
  pour Bottom (isolate 0.508, no thermals): 30.48,8.89 29.21,7.62 29.21,5.08 30.48,3.81 33.02,3.81 34.29,5.08 34.29,7.62 33.02,8.89
  pour Bottom (isolate 0.61, no thermals, hatched): 153.67,100.33 153.67,0 160.02,0 160.02,100.33
GUARDPULSE  (via drill 0.6)  (6 unrouted)
  Top 0.406: IC11.2 v25.4,16.51
IBUS0  (1 unrouted)
  Bottom 0.406: IC5.2 128.27,30.48 129.54,29.21 140.97,29.21 142.24,27.94 RN1.16 147.32,27.94 148.59,29.21 153.67,29.21 BUS.A24
IBUS1  (1 unrouted)
  Bottom 0.406: IC5.3 128.27,27.94 129.54,26.67 140.97,26.67 142.24,25.4 RN1.15 147.32,25.4 148.59,26.67 153.67,26.67 BUS.A25
IBUS2  (1 unrouted)
  Bottom 0.406: IC5.4 128.27,25.4 129.54,24.13 140.97,24.13 142.24,22.86 RN1.14 147.32,22.86 148.59,24.13 153.67,24.13 BUS.A26
IBUS3  (1 unrouted)
  Bottom 0.406: IC5.5 128.27,22.86 129.54,21.59 140.97,21.59 142.24,20.32 RN1.13 147.32,20.32 148.59,21.59 153.67,21.59 BUS.A27
IBUS4  (1 unrouted)
  Bottom 0.406: IC5.6 128.27,20.32 129.54,19.05 140.97,19.05 142.24,17.78 RN1.12 147.32,17.78 148.59,19.05 153.67,19.05 BUS.A28
IBUS5  (1 unrouted)
  Bottom 0.406: IC5.7 128.27,17.78 129.54,16.51 140.97,16.51 142.24,15.24 RN1.11 147.32,15.24 148.59,16.51 153.67,16.51 BUS.A29
IBUS6  (1 unrouted)
  Bottom 0.406: IC5.8 128.27,15.24 129.54,13.97 140.97,13.97 142.24,12.7 RN1.10 147.32,12.7 148.59,13.97 153.67,13.97 BUS.A30
IBUS7  (1 unrouted)
  Bottom 0.406: IC5.9 128.27,12.7 129.54,11.43 140.97,11.43 142.24,10.16 RN1.9 147.32,10.16 148.59,11.43 153.67,11.43 BUS.A31
IBUS8  (1 unrouted)
  Bottom 0.406: BUS.A5 153.67,80.01 148.59,80.01 147.32,78.74 RN2.16 140.97,78.74 139.7,80.01 129.54,80.01 128.27,81.28 IC1.2
IBUS9  (1 unrouted)
  Bottom 0.406: BUS.A6 153.67,77.47 148.59,77.47 147.32,76.2 RN2.15 142.24,76.2 140.97,77.47 129.54,77.47 128.27,78.74 IC1.3
IBUS10  (1 unrouted)
  Bottom 0.406: BUS.A7 153.67,74.93 147.32,74.93 146.05,73.66 RN2.14 142.24,73.66 140.97,74.93 129.54,74.93 128.27,76.2 IC1.4
IBUS11  (1 unrouted)
  Bottom 0.406: BUS.A8 153.67,72.39 147.32,72.39 146.05,71.12 RN2.13 142.24,71.12 140.97,72.39 129.54,72.39 128.27,73.66 IC1.5
IBUS12  (1 unrouted)
  Bottom 0.406: BUS.A9 153.67,69.85 147.32,69.85 146.05,68.58 RN2.12 142.24,68.58 140.97,69.85 129.54,69.85 128.27,71.12 IC1.6
IBUS13  (1 unrouted)
  Bottom 0.406: BUS.A10 153.67,67.31 147.32,67.31 146.05,66.04 RN2.11 142.24,66.04 140.97,67.31 129.54,67.31 128.27,68.58 IC1.7
IBUS14  (1 unrouted)
  Bottom 0.406: BUS.A11 153.67,64.77 147.32,64.77 146.05,63.5 RN2.10 142.24,63.5 140.97,64.77 129.54,64.77 128.27,66.04 IC1.8
IBUS15  (1 unrouted)
  Bottom 0.406: BUS.A12 153.67,62.23 147.32,62.23 146.05,60.96 RN2.9 142.24,60.96 140.97,62.23 129.54,62.23 128.27,63.5 IC1.9
N$1
  Bottom 0.406: IC5.18 RN1.1
N$2  (1 unrouted)
N$4
  Bottom 0.406: IC5.17 RN1.2
N$5  (2 unrouted)
N$6  (2 unrouted)
N$7
  Bottom 0.406: IC5.16 RN1.3
N$8  (1 unrouted)
N$9  (2 unrouted)
N$10  (1 unrouted)
N$11  (3 unrouted)
N$12  (2 unrouted)
N$13  (3 unrouted)
N$14  (2 unrouted)
N$15  (3 unrouted)
N$16  (2 unrouted)
N$17
  Bottom 0.406: IC5.15 RN1.4
N$18  (2 unrouted)
N$19  (3 unrouted)
N$20  (2 unrouted)
N$21
  Bottom 0.406: IC5.14 RN1.5
N$22
  Bottom 0.406: IC5.13 RN1.6
N$23
  Bottom 0.406: IC5.12 RN1.7
N$24
  Bottom 0.406: IC5.11 RN1.8
N$25
  Bottom 0.406: IC1.18 RN2.1
N$26
  Bottom 0.406: IC1.17 RN2.2
N$27
  Bottom 0.406: IC1.16 RN2.3
N$28
  Bottom 0.406: IC1.15 RN2.4
N$29
  Bottom 0.406: IC1.14 RN2.5
N$30
  Bottom 0.406: IC1.13 RN2.6
N$31
  Bottom 0.406: IC1.12 RN2.7
N$32
  Bottom 0.406: IC1.11 RN2.8
N$33
  Bottom 0.406: IC2.18 RN3.1
N$34
  Bottom 0.406: IC2.17 RN3.2
N$35
  Bottom 0.406: IC2.16 RN3.3
N$36
  Bottom 0.406: IC2.15 RN3.4
N$37
  Bottom 0.406: IC2.14 RN3.5
N$38
  Bottom 0.406: IC2.13 RN3.6
N$39
  Bottom 0.406: IC2.12 RN3.7
N$40
  Bottom 0.406: IC2.11 RN3.8
N$41
  Bottom 0.406: IC6.18 RN4.1
N$42
  Bottom 0.406: IC6.17 RN4.2
N$43
  Bottom 0.406: IC6.16 RN4.3
N$44
  Bottom 0.406: IC6.15 RN4.4
N$45
  Bottom 0.406: IC6.14 RN4.5
N$46
  Bottom 0.406: IC6.13 RN4.6
N$47
  Bottom 0.406: IC6.12 RN4.7
N$48
  Bottom 0.406: IC6.11 RN4.8
N$49  (2 unrouted)
NCLK1  (1 unrouted)
POWERLED  (1 unrouted)
RESET  (1 unrouted)
RESET-IN  (1 unrouted)
RUN  (1 unrouted)
STEP  (1 unrouted)
VCC  (via drill 0.6)  (52 unrouted)
  Top 0.406: IC11.5 18.1,15.56 v17.78,15.24
  pour Top (isolate 0.508, no thermals): 20.32,8.89 19.05,7.62 19.05,5.08 20.32,3.81 22.86,3.81 24.13,5.08 24.13,7.62 22.86,8.89
  pour Top (isolate 0.61, rank 2, no thermals): 153.67,100.33 153.67,0 160.02,0 160.02,100.33

### Text on the board
Top: (c) 2011 AlexiosC
Bottom: (c) 2011 AlexiosC
tNames: (c) 2011 AlexiosC | +5 | +4 | +3 | +2 | +1 | GP Phase | CFT CPU Power/Clock/Reset/Bus Term Rev D
tValues: +12V | +5V | GND